# Altium schematic sheet 0059_CAMERA_CONNECTOR.SchDoc
size 848 x 558 mm
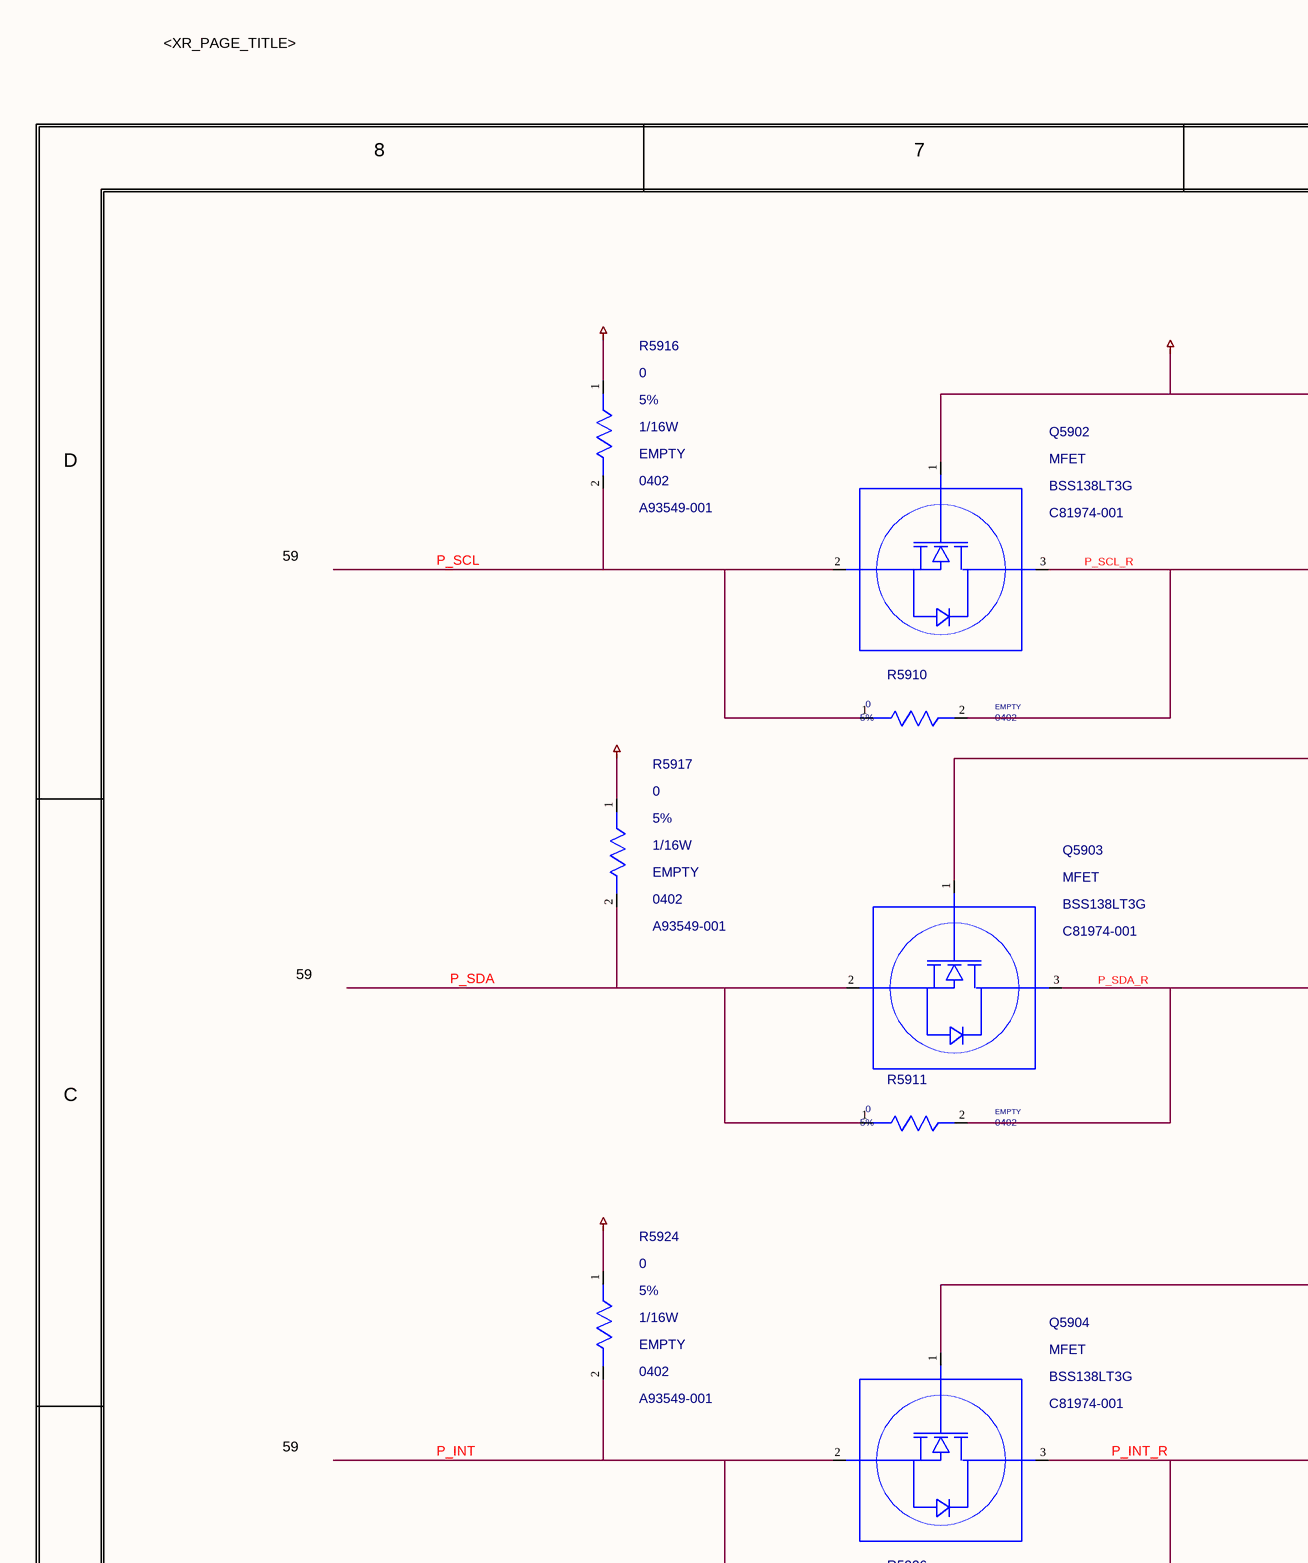
[diagram p0: 0059_CAMERA_CONNECTOR.SchDoc, top left]
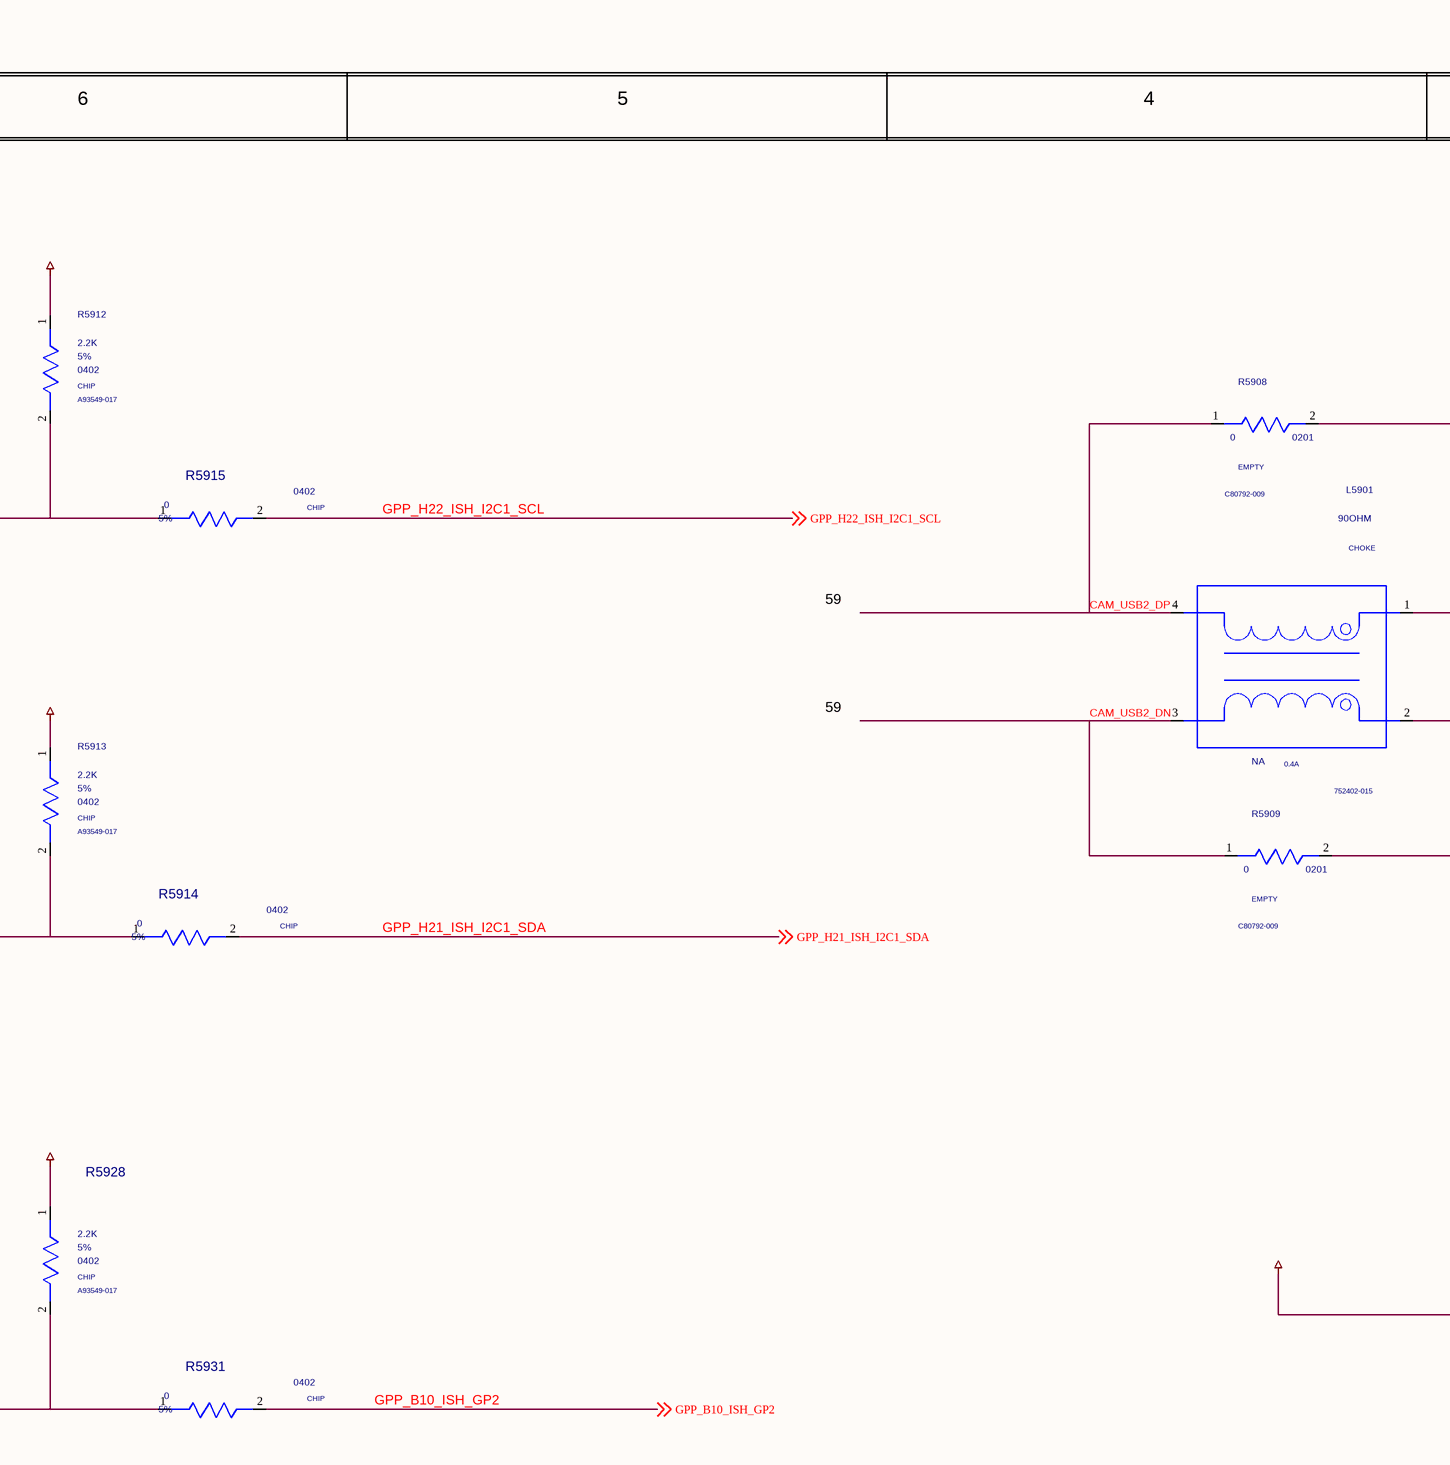
[diagram p1: 0059_CAMERA_CONNECTOR.SchDoc, top middle]
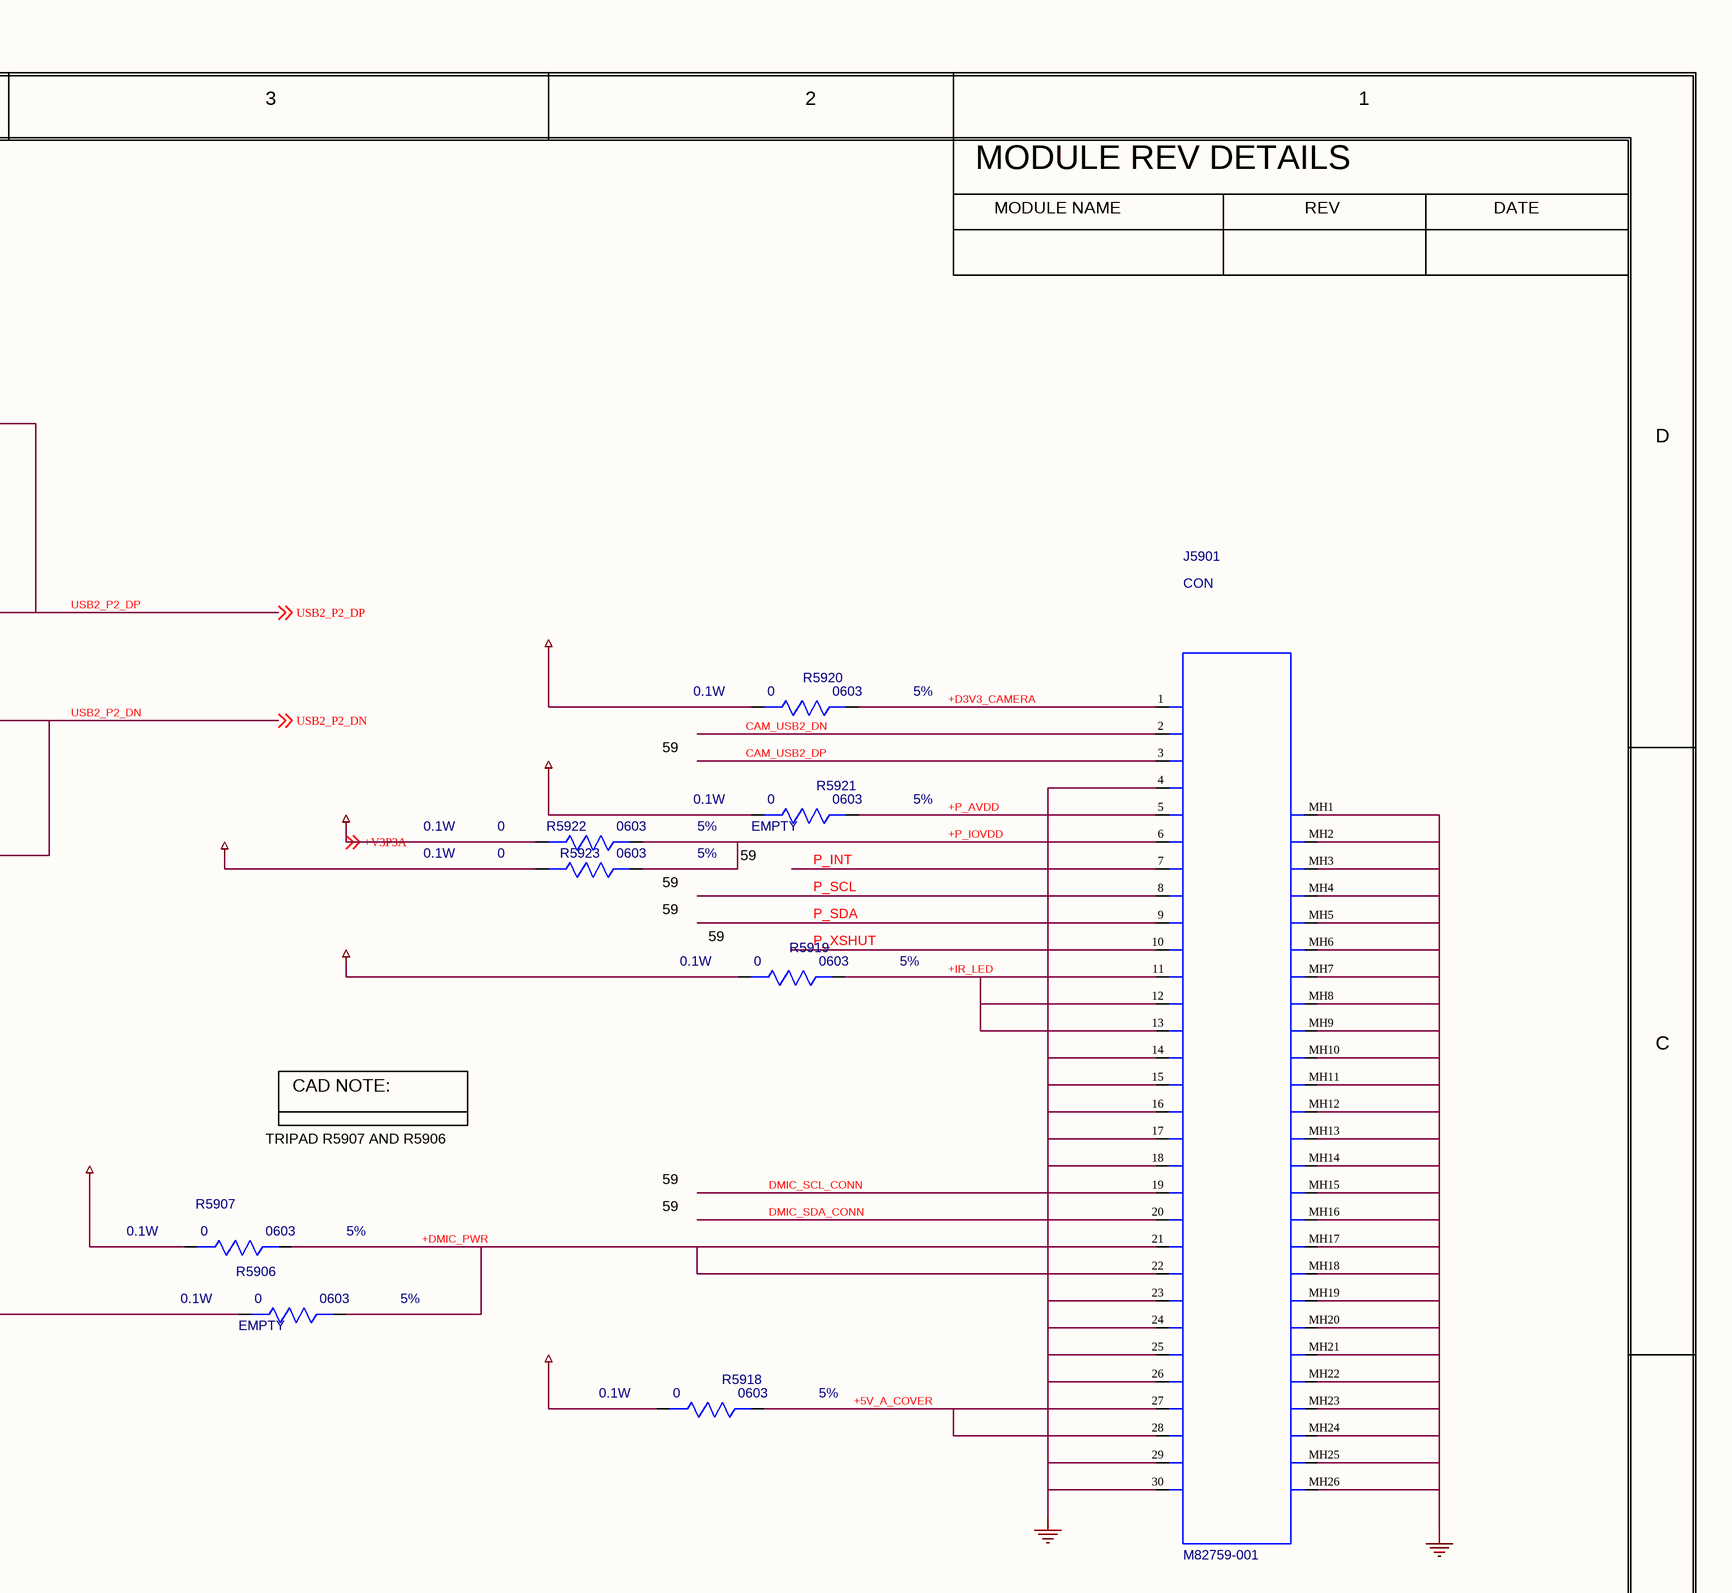
[diagram p2: 0059_CAMERA_CONNECTOR.SchDoc, top right]
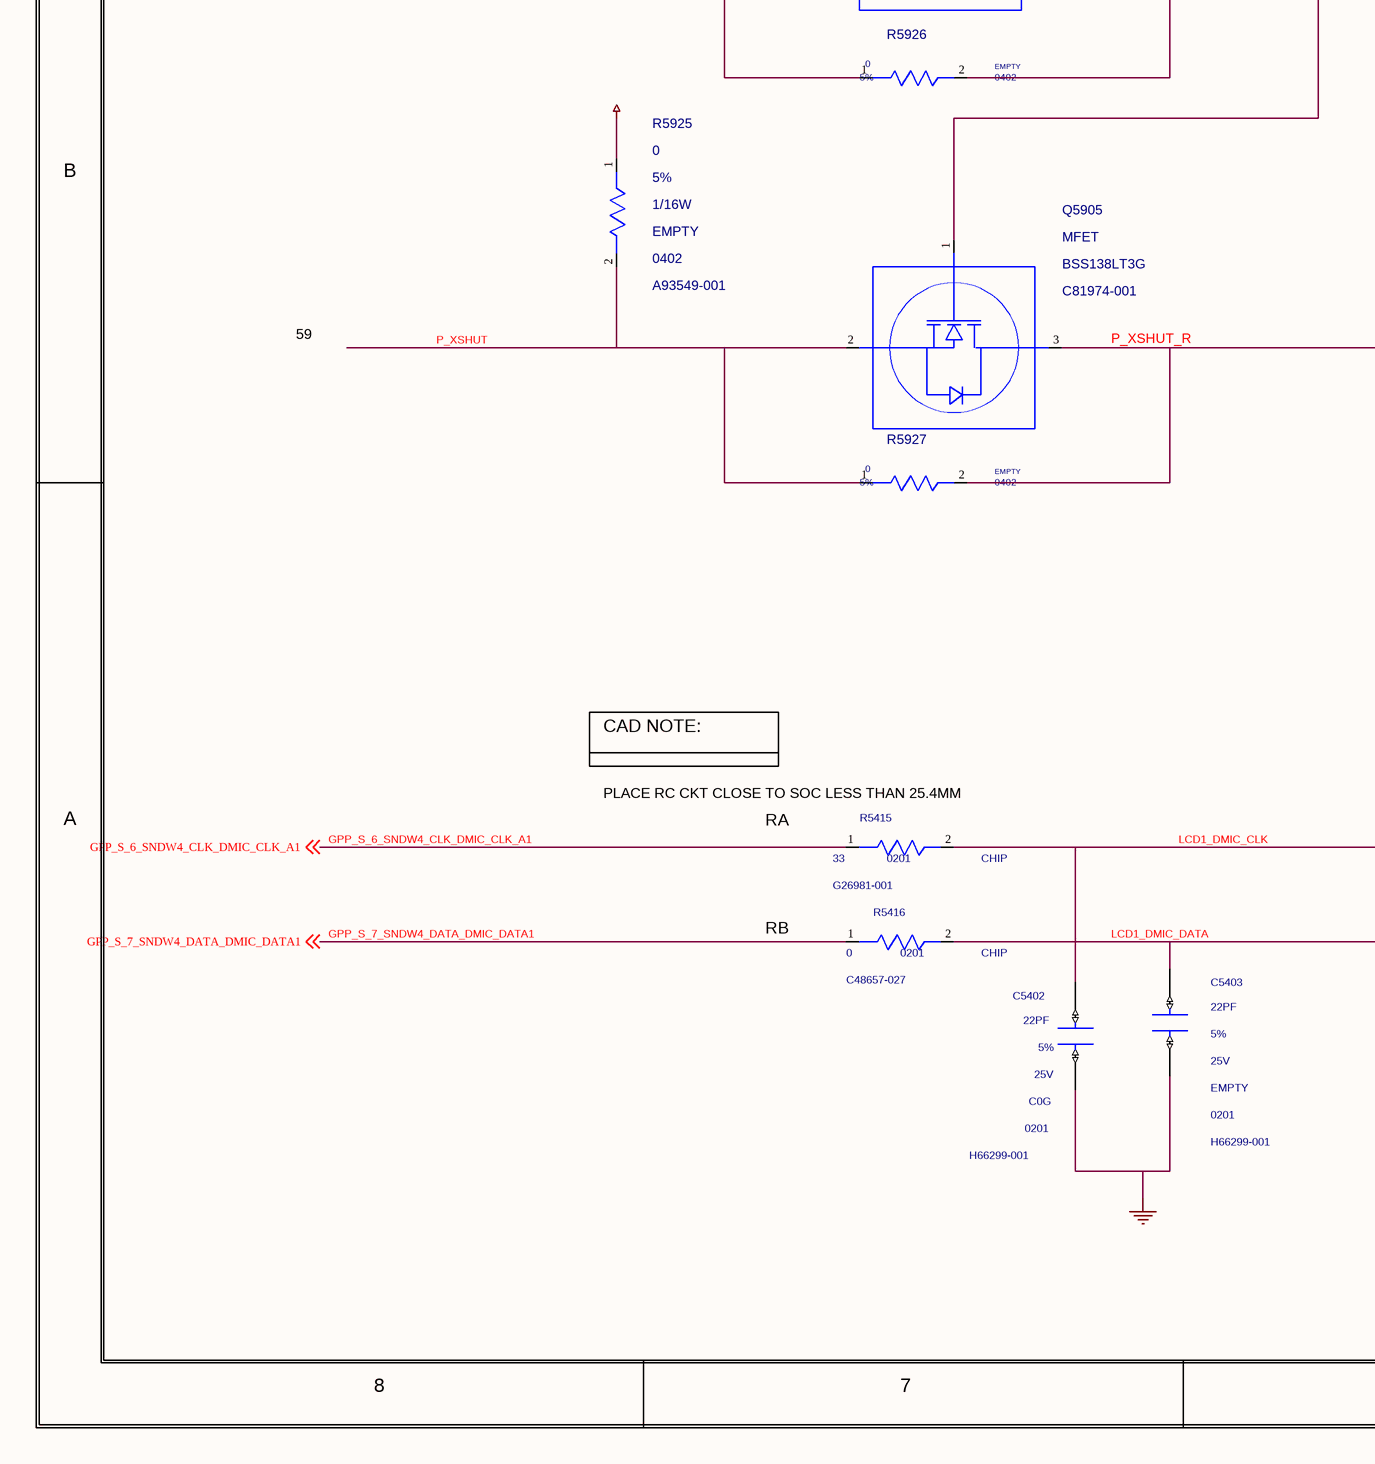
[diagram p3: 0059_CAMERA_CONNECTOR.SchDoc, bottom left]
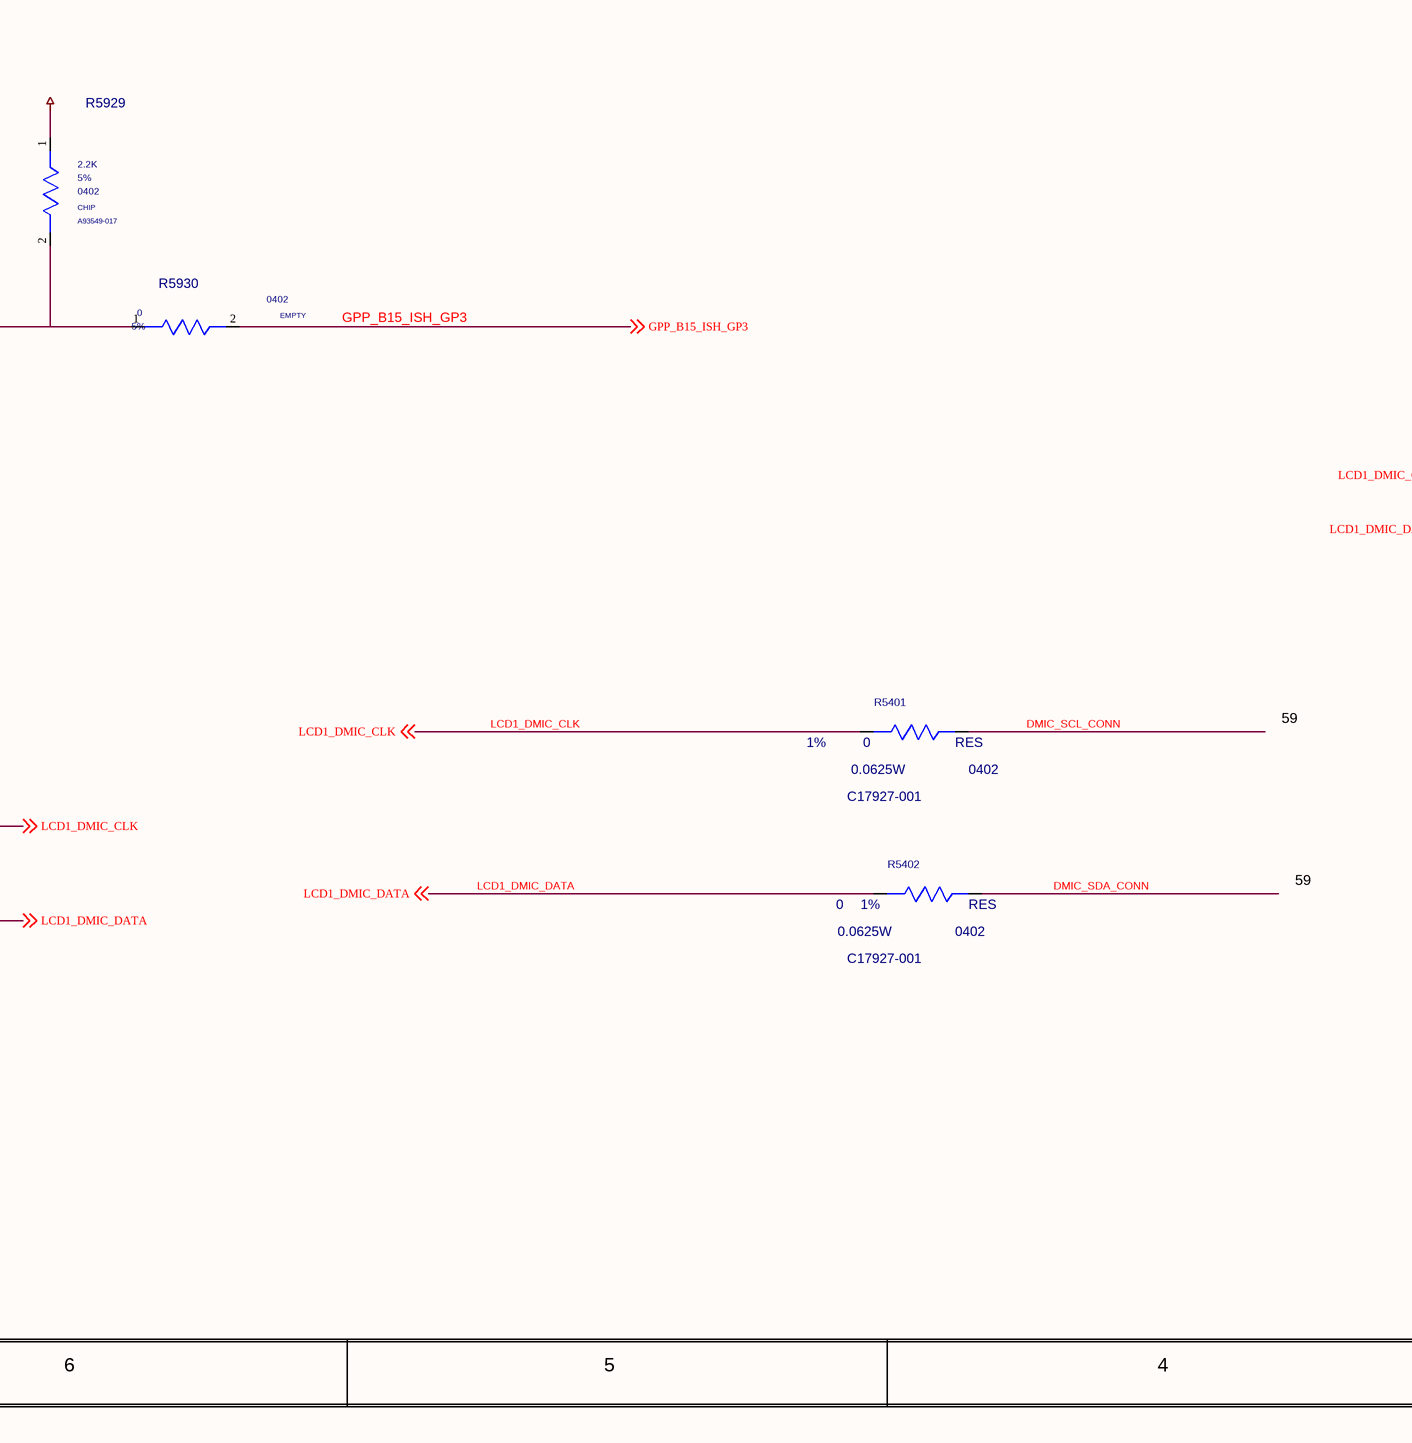
[diagram p4: 0059_CAMERA_CONNECTOR.SchDoc, bottom middle]
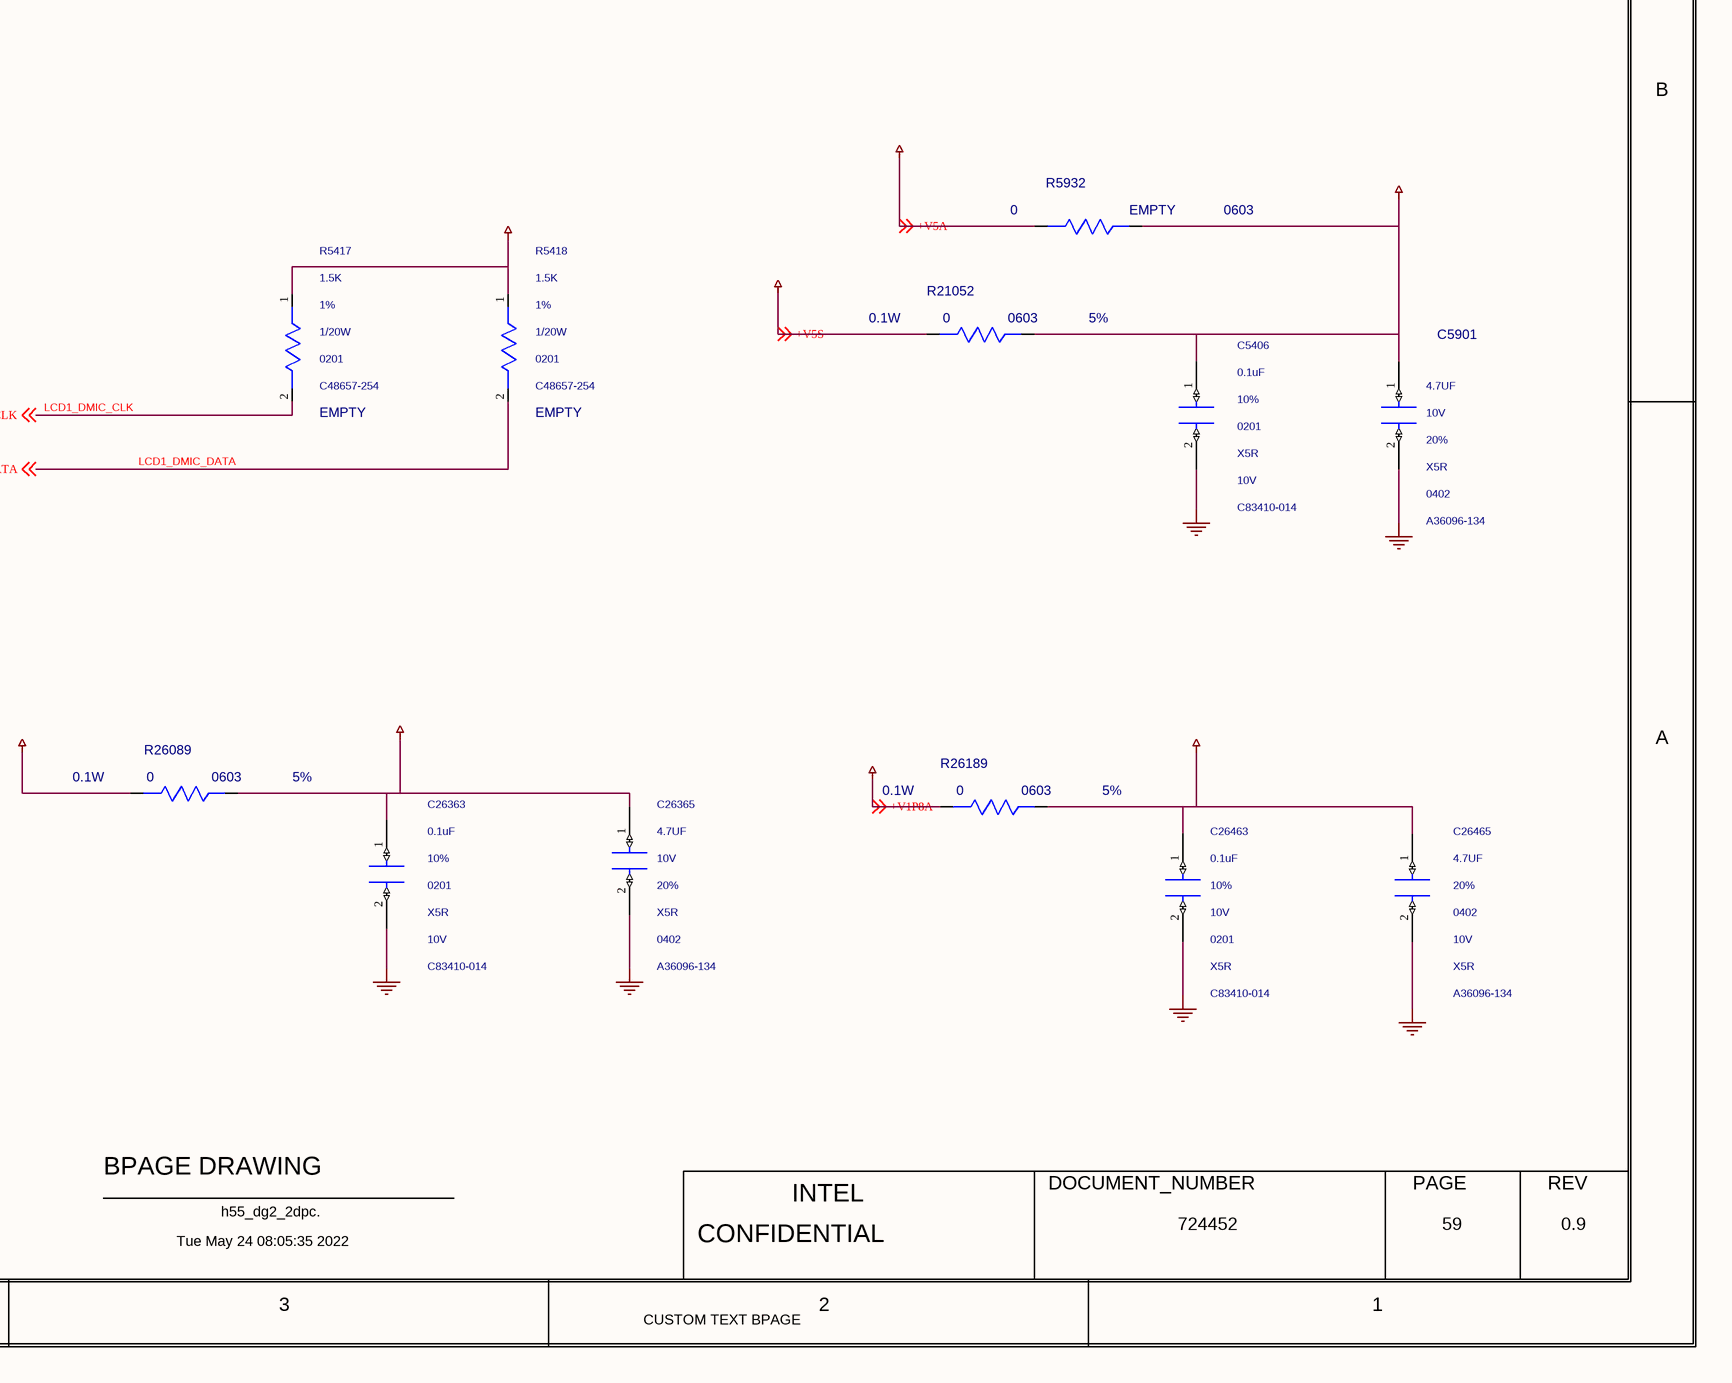
[diagram p5: 0059_CAMERA_CONNECTOR.SchDoc, bottom right]

## Parts
C5402  22PF  MATERIAL: C0G  PACK_TYPE: 0201  PART_NUMBER: H66299-001  TOLERANCE: 5%  VOLTAGE: 25V  [CTK0_SM0201_630X330_MA]
C5403  22PF  MATERIAL: EMPTY  PACK_TYPE: 0201  PART_NUMBER: H66299-001  TOLERANCE: 5%  VOLTAGE: 25V  [CTK0_SM0201_630X330_MA]
C5406  0.1uF  MATERIAL: X5R  PACK_TYPE: 0201  PART_NUMBER: C83410-014  TOLERANCE: 10%  VOLTAGE: 10V  [SMC0201IA]
C5901  4.7UF  MATERIAL: X5R  PACK_TYPE: 0402  PART_NUMBER: A36096-134  TOLERANCE: 20%  VOLTAGE: 10V  [SMC0402IA]
C26363  0.1uF  MATERIAL: X5R  PACK_TYPE: 0201  PART_NUMBER: C83410-014  TOLERANCE: 10%  VOLTAGE: 10V  [SMC0201IA]
C26365  4.7UF  MATERIAL: X5R  PACK_TYPE: 0402  PART_NUMBER: A36096-134  TOLERANCE: 20%  VOLTAGE: 10V  [SMC0402IA]
C26463  0.1uF  MATERIAL: X5R  PACK_TYPE: 0201  PART_NUMBER: C83410-014  TOLERANCE: 10%  VOLTAGE: 10V  [SMC0201IA]
C26465  4.7UF  MATERIAL: X5R  PACK_TYPE: 0402  PART_NUMBER: A36096-134  TOLERANCE: 20%  VOLTAGE: 10V  [SMC0402IA]
J5901  MATERIAL: CON  PART_NUMBER: M82759-001  [CTK1_B2B_SJR_1X30_26EM_400_MA_VR]  (hidden comment: C_B2B_1X30_26EM)
L5901  90OHM  CURRENT: 0.4A  MATERIAL: CHOKE  PART_NUMBER: 752402-015  TOLERANCE: NA  [SMI4_79X47IA]
Q5902  BSS138LT3G  MATERIAL: MFET  PART_NUMBER: C81974-001  [CTK2_SOT23_1400X3040_950_MA]
Q5903  BSS138LT3G  MATERIAL: MFET  PART_NUMBER: C81974-001  [CTK2_SOT23_1400X3040_950_MA]
Q5904  BSS138LT3G  MATERIAL: MFET  PART_NUMBER: C81974-001  [CTK2_SOT23_1400X3040_950_MA]
Q5905  BSS138LT3G  MATERIAL: MFET  PART_NUMBER: C81974-001  [CTK2_SOT23_1400X3040_950_MA]
R5401  0  MATERIAL: RES  PACK_TYPE: 0402  PART_NUMBER: C17927-001  TOLERANCE: 1%  WATTAGE: 0.0625W  [CTK0_SM0402_1100X550_MA]
R5402  0  MATERIAL: RES  PACK_TYPE: 0402  PART_NUMBER: C17927-001  TOLERANCE: 1%  WATTAGE: 0.0625W  [CTK0_SM0402_1100X550_MA]
R5415  33  MATERIAL: CHIP  PACK_TYPE: 0201  PART_NUMBER: G26981-001  [SMR0201IA]
R5416  0  MATERIAL: CHIP  PACK_TYPE: 0201  PART_NUMBER: C48657-027  [SMR0201IA]
R5417  1.5K  MATERIAL: EMPTY  PACK_TYPE: 0201  PART_NUMBER: C48657-254  TOLERANCE: 1%  WATTAGE: 1/20W  [SMR0201IA]
R5418  1.5K  MATERIAL: EMPTY  PACK_TYPE: 0201  PART_NUMBER: C48657-254  TOLERANCE: 1%  WATTAGE: 1/20W  [SMR0201IA]
R5906  0  MATERIAL: EMPTY  PACK_TYPE: 0603  TOLERANCE: 5%  WATTAGE: 0.1W  [CTK0_SM0603_1700X950_MA]
R5907  0  PACK_TYPE: 0603  TOLERANCE: 5%  WATTAGE: 0.1W  [CTK0_SM0603_1700X950_MA]
R5908  0  MATERIAL: EMPTY  PACK_TYPE: 0201  PART_NUMBER: C80792-009  [SMR0201IA]
R5909  0  MATERIAL: EMPTY  PACK_TYPE: 0201  PART_NUMBER: C80792-009  [SMR0201IA]
R5910  0  MATERIAL: EMPTY  PACK_TYPE: 0402  TOLERANCE: 5%  [SMR0402IA]
R5911  0  MATERIAL: EMPTY  PACK_TYPE: 0402  TOLERANCE: 5%  [SMR0402IA]
R5912  2.2K  MATERIAL: CHIP  PACK_TYPE: 0402  PART_NUMBER: A93549-017  TOLERANCE: 5%  [SMR0402IA]
R5913  2.2K  MATERIAL: CHIP  PACK_TYPE: 0402  PART_NUMBER: A93549-017  TOLERANCE: 5%  [SMR0402IA]
R5914  0  MATERIAL: CHIP  PACK_TYPE: 0402  TOLERANCE: 5%  [SMR0402IA]
R5915  0  MATERIAL: CHIP  PACK_TYPE: 0402  TOLERANCE: 5%  [SMR0402IA]
R5916  0  MATERIAL: EMPTY  PACK_TYPE: 0402  PART_NUMBER: A93549-001  TOLERANCE: 5%  WATTAGE: 1/16W  [SMR0402IA]
R5917  0  MATERIAL: EMPTY  PACK_TYPE: 0402  PART_NUMBER: A93549-001  TOLERANCE: 5%  WATTAGE: 1/16W  [SMR0402IA]
R5918  0  PACK_TYPE: 0603  TOLERANCE: 5%  WATTAGE: 0.1W  [CTK0_SM0603_1700X950_MA]
R5919  0  PACK_TYPE: 0603  TOLERANCE: 5%  WATTAGE: 0.1W  [CTK0_SM0603_1700X950_MA]
R5920  0  PACK_TYPE: 0603  TOLERANCE: 5%  WATTAGE: 0.1W  [CTK0_SM0603_1700X950_MA]
R5921  0  PACK_TYPE: 0603  TOLERANCE: 5%  WATTAGE: 0.1W  [CTK0_SM0603_1700X950_MA]
R5922  0  MATERIAL: EMPTY  PACK_TYPE: 0603  TOLERANCE: 5%  WATTAGE: 0.1W  [CTK0_SM0603_1700X950_MA]
R5923  0  PACK_TYPE: 0603  TOLERANCE: 5%  WATTAGE: 0.1W  [CTK0_SM0603_1700X950_MA]
R5924  0  MATERIAL: EMPTY  PACK_TYPE: 0402  PART_NUMBER: A93549-001  TOLERANCE: 5%  WATTAGE: 1/16W  [SMR0402IA]
R5925  0  MATERIAL: EMPTY  PACK_TYPE: 0402  PART_NUMBER: A93549-001  TOLERANCE: 5%  WATTAGE: 1/16W  [SMR0402IA]
R5926  0  MATERIAL: EMPTY  PACK_TYPE: 0402  TOLERANCE: 5%  [SMR0402IA]
R5927  0  MATERIAL: EMPTY  PACK_TYPE: 0402  TOLERANCE: 5%  [SMR0402IA]
R5928  2.2K  MATERIAL: CHIP  PACK_TYPE: 0402  PART_NUMBER: A93549-017  TOLERANCE: 5%  [SMR0402IA]
R5929  2.2K  MATERIAL: CHIP  PACK_TYPE: 0402  PART_NUMBER: A93549-017  TOLERANCE: 5%  [SMR0402IA]
R5930  0  MATERIAL: EMPTY  PACK_TYPE: 0402  TOLERANCE: 5%  [SMR0402IA]
R5931  0  MATERIAL: CHIP  PACK_TYPE: 0402  TOLERANCE: 5%  [SMR0402IA]
R5932  0  MATERIAL: EMPTY  PACK_TYPE: 0603  [CTK2_SM0603_1700X950_MA]
R21052  0  PACK_TYPE: 0603  TOLERANCE: 5%  WATTAGE: 0.1W  [CTK0_SM0603_1700X950_MA]
R26089  0  PACK_TYPE: 0603  TOLERANCE: 5%  WATTAGE: 0.1W  [CTK0_SM0603_1700X950_MA]
R26189  0  PACK_TYPE: 0603  TOLERANCE: 5%  WATTAGE: 0.1W  [CTK0_SM0603_1700X950_MA]

## Nets
+V1P8A: Q5902.1(G) Q5903.1(G) Q5904.1(G) Q5905.1(G) R5916.1(A) R5917.1(A) R5923.1(A) R5924.1(A) R5925.1(A) R26189.1(A) ; off-sheet +V1P8A
+V1P8A_DMIC: C26463.1(A) C26465.1(A) R5417.1(A) R5418.1(A) R5907.1(A) R26189.2(B)
+V3P3A: R5912.1(A) R5913.1(A) R5922.1(A) R5928.1(A) R5929.1(A) R26089.1(A) ; off-sheet +V3P3A
+V3P3A_CAMERA: C26363.1(A) C26365.1(A) R5906.1(A) R5920.1(A) R5921.1(A) R26089.2(B)
+V5A: R5932.1(A) ; off-sheet +V5A
+V5A_A_BL: C5406.1(A) C5901.1(A) R5918.1(A) R5919.1(A) R5932.2(B) R21052.2(B)
+V5S: R21052.1(A) ; off-sheet +V5S
GND: C5402.2(B) C5403.2(B) C5406.2(B) C5901.2(B) C26363.2(B) C26365.2(B) C26463.2(B) C26465.2(B) J5901.4(IO4) J5901.14(IO14) J5901.15(IO15) J5901.16(IO16) J5901.17(IO17) J5901.18(IO18) J5901.23(IO23) J5901.24(IO24) J5901.25(IO25) J5901.26(IO26) J5901.29(IO29) J5901.30(IO30) J5901.MH1 J5901.MH2 J5901.MH3 J5901.MH4 J5901.MH5 J5901.MH6 J5901.MH7 J5901.MH8 J5901.MH9 J5901.MH10 J5901.MH11 J5901.MH12 J5901.MH13 J5901.MH14 J5901.MH15 J5901.MH16 J5901.MH17 J5901.MH18 J5901.MH19 J5901.MH20 J5901.MH21 J5901.MH22 J5901.MH23 J5901.MH24 J5901.MH25 J5901.MH26
+5V_A_COVER: J5901.27(IO27) J5901.28(IO28) R5918.2(B)
+D3V3_CAMERA: J5901.1(IO1) R5920.2(B)
+DMIC_PWR: J5901.21(IO21) J5901.22(IO22) R5906.2(B) R5907.2(B)
+IR_LED: J5901.11(IO11) J5901.12(IO12) J5901.13(IO13) R5919.2(B)
+P_AVDD: J5901.5(IO5) R5921.2(B)
+P_IOVDD: J5901.6(IO6) R5922.2(B) R5923.2(B)
CAM_USB2_DN: J5901.2(IO2) L5901.3(IN_2) R5909.1(A)
CAM_USB2_DP: J5901.3(IO3) L5901.4(OUT_1) R5908.1(A)
DMIC_SCL_CONN: J5901.19(IO19) R5401.2(B)
DMIC_SDA_CONN: J5901.20(IO20) R5402.2(B)
GPP_B10_ISH_GP2: R5931.2(B) ; off-sheet GPP_B10_ISH_GP2
GPP_B15_ISH_GP3: R5930.2(B) ; off-sheet GPP_B15_ISH_GP3
GPP_H21_ISH_I2C1_SDA: R5914.2(B) ; off-sheet GPP_H21_ISH_I2C1_SDA
GPP_H22_ISH_I2C1_SCL: R5915.2(B) ; off-sheet GPP_H22_ISH_I2C1_SCL
GPP_S_6_SNDW4_CLK_DMIC_CLK_A1: R5415.1(A) ; off-sheet GPP_S_6_SNDW4_CLK_DMIC_CLK_A1
GPP_S_7_SNDW4_DATA_DMIC_DATA1: R5416.1(A) ; off-sheet GPP_S_7_SNDW4_DATA_DMIC_DATA1
LCD1_DMIC_CLK: C5402.1(A) R5401.1(A) R5415.2(B) R5417.2(B) ; off-sheet LCD1_DMIC_CLK
LCD1_DMIC_DATA: C5403.1(A) R5402.1(A) R5416.2(B) R5418.2(B) ; off-sheet LCD1_DMIC_DATA
P_INT: J5901.7(IO7) Q5904.2(S) R5924.2(B) R5926.1(A)
P_INT_R: Q5904.3(D) R5926.2(B) R5928.2(B) R5931.1(A)
P_SCL: J5901.8(IO8) Q5902.2(S) R5910.1(A) R5916.2(B)
P_SCL_R: Q5902.3(D) R5910.2(B) R5912.2(B) R5915.1(A)
P_SDA: J5901.9(IO9) Q5903.2(S) R5911.1(A) R5917.2(B)
P_SDA_R: Q5903.3(D) R5911.2(B) R5913.2(B) R5914.1(A)
P_XSHUT: J5901.10(IO10) Q5905.2(S) R5925.2(B) R5927.1(A)
P_XSHUT_R: Q5905.3(D) R5927.2(B) R5929.2(B) R5930.1(A)
USB2_P2_DN: L5901.2(OUT_2) R5909.2(B) ; off-sheet USB2_P2_DN
USB2_P2_DP: L5901.1(IN_1) R5908.2(B) ; off-sheet USB2_P2_DP

## Notes on the sheet
- <XR_PAGE_TITLE>
- 8
- 7
- 6
- 5
- 4
- 3
- 2
- 1
- MODULE REV DETAILS
- MODULE NAME
- REV
- DATE
- D
- 59
- (near R5921) 59
- (near R5919) 59
- C
- TRIPAD R5907 AND R5906
- CAD NOTE:
- B
- (near R5415) PLACE RC CKT CLOSE TO SOC LESS THAN 25.4MM
- A
- RA
- RB
- BPAGE DRAWING
- INTEL
- DOCUMENT_NUMBER
- PAGE
- Tue May 24 08:05:35 2022
- h55_dg2_2dpc.
- CONFIDENTIAL
- 724452
- 0.9
- CUSTOM TEXT BPAGE

## Library data of the parts
C5402 = C_CAP: CDS_PHYS_PART_NAME: C_CAP_0201-H66299-001,C0G,22PF,25V,5%,TK0,GENERIC; CDS_LMAN_SYM_OUTLINE: -50,50,50,-50; FP_TECH: TK0; IP: GENERIC; ROOM: NONE; OriginalSymbolOrigin: (-50,25); XY: (3625,700); VER: 1; SUB_ROOM: DECOUPLING; ROT: 0; PHYS_PAGE: 59; LOCATION: C5402; DRAWING: @RVP1_ADL_SB_ADP_S_DDR5_SODIMM_2DPC_LIB.H55_DG2_2DPC(SCH_1):PAGE59; CDS_LIB: c_discrete; VARIANT: ?; PCB Footprint: CTK0_SM0201_630X330_MA; CHIPS_PART_NAME: C_CAP; CDS_PART_NAME: C_CAP_0201-H66299-001,C0G,22PF,25V,5%,TK0,GENERIC; CDS_LOCATION: C5402
C5403 = C_CAP: CDS_PHYS_PART_NAME: C_CAP_0201-H66299-001,EMPTY,22PF,25V,5%,TK0,GENERIC; CDS_LMAN_SYM_OUTLINE: -50,50,50,-50; FP_TECH: TK0; IP: GENERIC; ROOM: NONE; OriginalSymbolOrigin: (-50,25); XY: (3800,725); VER: 1; SUB_ROOM: DECOUPLING; ROT: 2; PHYS_PAGE: 59; LOCATION: C5403; DRAWING: @RVP1_ADL_SB_ADP_S_DDR5_SODIMM_2DPC_LIB.H55_DG2_2DPC(SCH_1):PAGE59; CDS_LIB: c_discrete; VARIANT: ?; PCB Footprint: CTK0_SM0201_630X330_MA; CHIPS_PART_NAME: C_CAP; CDS_PART_NAME: C_CAP_0201-H66299-001,EMPTY,22PF,25V,5%,TK0,GENERIC; CDS_LOCATION: C5403
C5406 = CAP: CDS_PHYS_PART_NAME: CAP_0201-C83410-014,X5R,0.1UF,10V,10%,LPDB,GENERIC; OriginalSymbolOrigin: (-50,25); XY: (9025,1700); VER: 1; SUB_ROOM_2: DECOUPLING; SUB_ROOM_1: TOUCH-1; ROT: 0; PHYS_PAGE: 59; LOCATION: C5406; DRAWING: @RVP1_ADL_SB_ADP_S_DDR5_SODIMM_2DPC_LIB.H55_DG2_2DPC(SCH_1):PAGE59; CDS_LIB: discrete; PCB Footprint: SMC0201IA; CHIPS_PART_NAME: CAP; CDS_PART_NAME: CAP_0201-C83410-014,X5R,0.1UF,10V,10%,LPDB,GENERIC; CDS_LOCATION: C5406
C5901 = CAP: CDS_PHYS_PART_NAME: CAP_0402-A36096-134,X5R,4.7UF,10V,20%,LPDB,GENERIC; OriginalSymbolOrigin: (-50,25); XY: (9400,1700); VER: 1; SUB_ROOM_2: DECOUPLING; SUB_ROOM_1: TOUCH-1; ROT: 0; PHYS_PAGE: 59; LOCATION: C5901; DRAWING: @RVP1_ADL_SB_ADP_S_DDR5_SODIMM_2DPC_LIB.H55_DG2_2DPC(SCH_1):PAGE59; CDS_LIB: discrete; PCB Footprint: SMC0402IA; CHIPS_PART_NAME: CAP; CDS_PART_NAME: CAP_0402-A36096-134,X5R,4.7UF,10V,20%,LPDB,GENERIC; CDS_LOCATION: C5901
C26363 = CAP: CDS_PHYS_PART_NAME: CAP_0201-C83410-014,X5R,0.1UF,10V,10%,LPDB,GENERIC; OriginalSymbolOrigin: (-50,25); XY: (7525,850); VER: 1; SUB_ROOM_2: DECOUPLING; SUB_ROOM_1: TOUCH-1; ROT: 0; PHYS_PAGE: 59; LOCATION: C26363; DRAWING: @RVP1_ADL_SB_ADP_S_DDR5_SODIMM_2DPC_LIB.H55_DG2_2DPC(SCH_1):PAGE59; CDS_LIB: discrete; PCB Footprint: SMC0201IA; CHIPS_PART_NAME: CAP; CDS_PART_NAME: CAP_0201-C83410-014,X5R,0.1UF,10V,10%,LPDB,GENERIC; CDS_LOCATION: C26363
C26365 = CAP: CDS_PHYS_PART_NAME: CAP_0402-A36096-134,X5R,4.7UF,10V,20%,LPDB,GENERIC; OriginalSymbolOrigin: (-50,25); XY: (7975,875); VER: 1; SUB_ROOM_2: DECOUPLING; SUB_ROOM_1: TOUCH-1; ROT: 0; PHYS_PAGE: 59; LOCATION: C26365; DRAWING: @RVP1_ADL_SB_ADP_S_DDR5_SODIMM_2DPC_LIB.H55_DG2_2DPC(SCH_1):PAGE59; CDS_LIB: discrete; PCB Footprint: SMC0402IA; CHIPS_PART_NAME: CAP; CDS_PART_NAME: CAP_0402-A36096-134,X5R,4.7UF,10V,20%,LPDB,GENERIC; CDS_LOCATION: C26365
C26463 = CAP: CDS_PHYS_PART_NAME: CAP_0201-C83410-014,X5R,0.1UF,10V,10%,LPDB,GENERIC; OriginalSymbolOrigin: (-50,25); XY: (9000,825); VER: 1; SUB_ROOM_2: DECOUPLING; SUB_ROOM_1: TOUCH-1; ROT: 0; PHYS_PAGE: 59; LOCATION: C26463; DRAWING: @RVP1_ADL_SB_ADP_S_DDR5_SODIMM_2DPC_LIB.H55_DG2_2DPC(SCH_1):PAGE59; CDS_LIB: discrete; PCB Footprint: SMC0201IA; CHIPS_PART_NAME: CAP; CDS_PART_NAME: CAP_0201-C83410-014,X5R,0.1UF,10V,10%,LPDB,GENERIC; CDS_LOCATION: C26463
C26465 = CAP: CDS_PHYS_PART_NAME: CAP_0402-A36096-134,X5R,4.7UF,10V,20%,LPDB,GENERIC; OriginalSymbolOrigin: (-50,25); XY: (9425,825); VER: 1; SUB_ROOM_2: DECOUPLING; SUB_ROOM_1: TOUCH-1; ROT: 0; PHYS_PAGE: 59; LOCATION: C26465; DRAWING: @RVP1_ADL_SB_ADP_S_DDR5_SODIMM_2DPC_LIB.H55_DG2_2DPC(SCH_1):PAGE59; CDS_LIB: discrete; PCB Footprint: SMC0402IA; CHIPS_PART_NAME: CAP; CDS_PART_NAME: CAP_0402-A36096-134,X5R,4.7UF,10V,20%,LPDB,GENERIC; CDS_LOCATION: C26465
J5901 = C_B2B_1X30_26EM: CDS_PHYS_PART_NAME: C_B2B_1X30_26EM_SM-M82759-001,CON,B2B_1X30_26EM,TK1,GENERIC; CDS_LMAN_SYM_OUTLINE: -100,800,100,-850; FP_TECH: TK1; IP: GENERIC; PACK_TYPE: SM; ROOM: NONE; OriginalSymbolOrigin: (-125,800); XY: (9100,3350); VER: 1; ROT: 0; PHYS_PAGE: 59; LOCATION: J5901; DRAWING: @RVP1_ADL_SB_ADP_S_DDR5_SODIMM_2DPC_LIB.H55_DG2_2DPC(SCH_1):PAGE59; CDS_LIB: local; VARIANT: ?; PCB Footprint: CTK1_B2B_SJR_1X30_26EM_400_MA_VR; SEC_TYPE: SM; CHIPS_PART_NAME: C_B2B_1X30_26EM; CDS_PART_NAME: C_B2B_1X30_26EM_SM-M82759-001,CON,B2B_1X30_26EM,TK1,GENERIC; CDS_LOCATION: J5901
L5901 = IND_4PIN: CDS_PHYS_PART_NAME: IND_4PIN_0805-752402-015,CHOKE,90OHM,NA,0.4A,LPDB,GENERIC; CDS_LMAN_SYM_OUTLINE: -200,150,150,-150; PACK_TYPE: 0805; OriginalSymbolOrigin: (-225,150); XY: (6550,4125); VER: 2; PHYS_PAGE: 59; LOCATION: L5901; IP: GENERIC; FP_TECH: LPDB; DRAWING: @RVP1_ADL_SB_ADP_S_DDR5_SODIMM_2DPC_LIB.H55_DG2_2DPC(SCH_1):PAGE59; CDS_LIB: discrete; PCB Footprint: SMI4_79X47IA; SEC_TYPE: 0805; ROT: 2; CHIPS_PART_NAME: IND_4PIN; CDS_PART_NAME: IND_4PIN_0805-752402-015,CHOKE,90OHM,NA,0.4A,LPDB,GENERIC; CDS_LOCATION: L5901
Q5902 = C_MOSFET_N#1: CDS_PHYS_PART_NAME: C_MOSFET_N_SOT23-C81974-001,MFET,BSS138LT3G,TK2,GENERIC; CDS_LMAN_SYM_OUTLINE: -150,150,150,-150; FP_TECH: TK2; IP: GENERIC; PACK_TYPE: SOT23; ROOM: NONE; OriginalSymbolOrigin: (-175,175); XY: (3375,4400); VER: 1; ROT: 5; PHYS_PAGE: 59; LOCATION: Q5902; DRAWING: @RVP1_ADL_SB_ADP_S_DDR5_SODIMM_2DPC_LIB.H55_DG2_2DPC(SCH_1):PAGE59; CDS_LIB: local; VARIANT: ?; PCB Footprint: CTK2_SOT23_1400X3040_950_MA; CHIPS_PART_NAME: C_MOSFET_N; CDS_PART_NAME: C_MOSFET_N_SOT23-C81974-001,MFET,BSS138LT3G,TK2,GENERIC; CDS_LOCATION: Q5902
Q5903 = C_MOSFET_N#1: CDS_PHYS_PART_NAME: C_MOSFET_N_SOT23-C81974-001,MFET,BSS138LT3G,TK2,GENERIC; CDS_LMAN_SYM_OUTLINE: -150,150,150,-150; FP_TECH: TK2; IP: GENERIC; PACK_TYPE: SOT23; ROOM: NONE; OriginalSymbolOrigin: (-175,175); XY: (3400,3625); VER: 1; ROT: 5; PHYS_PAGE: 59; LOCATION: Q5903; DRAWING: @RVP1_ADL_SB_ADP_S_DDR5_SODIMM_2DPC_LIB.H55_DG2_2DPC(SCH_1):PAGE59; CDS_LIB: local; VARIANT: ?; PCB Footprint: CTK2_SOT23_1400X3040_950_MA; CHIPS_PART_NAME: C_MOSFET_N; CDS_PART_NAME: C_MOSFET_N_SOT23-C81974-001,MFET,BSS138LT3G,TK2,GENERIC; CDS_LOCATION: Q5903
Q5904 = C_MOSFET_N#1: CDS_PHYS_PART_NAME: C_MOSFET_N_SOT23-C81974-001,MFET,BSS138LT3G,TK2,GENERIC; CDS_LMAN_SYM_OUTLINE: -150,150,150,-150; FP_TECH: TK2; IP: GENERIC; PACK_TYPE: SOT23; ROOM: NONE; OriginalSymbolOrigin: (-175,175); XY: (3375,2750); VER: 1; ROT: 5; PHYS_PAGE: 59; LOCATION: Q5904; DRAWING: @RVP1_ADL_SB_ADP_S_DDR5_SODIMM_2DPC_LIB.H55_DG2_2DPC(SCH_1):PAGE59; CDS_LIB: local; VARIANT: ?; PCB Footprint: CTK2_SOT23_1400X3040_950_MA; CHIPS_PART_NAME: C_MOSFET_N; CDS_PART_NAME: C_MOSFET_N_SOT23-C81974-001,MFET,BSS138LT3G,TK2,GENERIC; CDS_LOCATION: Q5904
Q5905 = C_MOSFET_N#1: CDS_PHYS_PART_NAME: C_MOSFET_N_SOT23-C81974-001,MFET,BSS138LT3G,TK2,GENERIC; CDS_LMAN_SYM_OUTLINE: -150,150,150,-150; FP_TECH: TK2; IP: GENERIC; PACK_TYPE: SOT23; ROOM: NONE; OriginalSymbolOrigin: (-175,175); XY: (3400,1975); VER: 1; ROT: 5; PHYS_PAGE: 59; LOCATION: Q5905; DRAWING: @RVP1_ADL_SB_ADP_S_DDR5_SODIMM_2DPC_LIB.H55_DG2_2DPC(SCH_1):PAGE59; CDS_LIB: local; VARIANT: ?; PCB Footprint: CTK2_SOT23_1400X3040_950_MA; CHIPS_PART_NAME: C_MOSFET_N; CDS_PART_NAME: C_MOSFET_N_SOT23-C81974-001,MFET,BSS138LT3G,TK2,GENERIC; CDS_LOCATION: Q5905
R5401 = C_RES#1: CHIPS_PART_NAME: C_RES; CDS_PHYS_PART_NAME: C_RES_0402-C17927-001,RES,0,1%,0.0625W,TK0,GENERIC; CDS_LMAN_SYM_OUTLINE: -50,50,50,-50; FP_TECH: TK0; IP: GENERIC; ROOM: NONE; OriginalSymbolOrigin: (-75,25); XY: (5875,1225); VER: 1; SUB_ROOM_2: MISC; SUB_ROOM_1: TOUCH-1; PHYS_PAGE: 59; LOCATION: R5401; DRAWING: @RVP1_ADL_SB_ADP_S_DDR5_SODIMM_2DPC_LIB.H55_DG2_2DPC(SCH_1):PAGE59; CDS_LIB: c_discrete; VARIANT: ?; PCB Footprint: CTK0_SM0402_1100X550_MA; SEC_TYPE: 0402; ROT: 0; CDS_PART_NAME: C_RES_0402-C17927-001,RES,0,1%,0.0625W,TK0,GENERIC; CDS_LOCATION: R5401
R5402 = C_RES#1: CHIPS_PART_NAME: C_RES; CDS_PHYS_PART_NAME: C_RES_0402-C17927-001,RES,0,1%,0.0625W,TK0,GENERIC; CDS_LMAN_SYM_OUTLINE: -50,50,50,-50; FP_TECH: TK0; IP: GENERIC; ROOM: NONE; OriginalSymbolOrigin: (-75,25); XY: (5900,925); VER: 1; SUB_ROOM_2: MISC; SUB_ROOM_1: TOUCH-1; PHYS_PAGE: 59; LOCATION: R5402; DRAWING: @RVP1_ADL_SB_ADP_S_DDR5_SODIMM_2DPC_LIB.H55_DG2_2DPC(SCH_1):PAGE59; CDS_LIB: c_discrete; VARIANT: ?; PCB Footprint: CTK0_SM0402_1100X550_MA; SEC_TYPE: 0402; ROT: 0; CDS_PART_NAME: C_RES_0402-C17927-001,RES,0,1%,0.0625W,TK0,GENERIC; CDS_LOCATION: R5402
R5415 = RES#1: CHIPS_PART_NAME: RES; CDS_PHYS_PART_NAME: RES_0201-G26981-001,CHIP,33,5%,0.05W,LPDB,GENERIC; TOLERANCE: 5%; WATTAGE: 0.05W; OriginalSymbolOrigin: (-75,25); XY: (3300,1050); VER: 1; SUB_ROOM: TERMINATION; ROT: 0; PHYS_PAGE: 59; LOCATION: R5415; IP: GENERIC; FP_TECH: LPDB; DRAWING: @RVP1_ADL_SB_ADP_S_DDR5_SODIMM_2DPC_LIB.H55_DG2_2DPC(SCH_1):PAGE59; CDS_LIB: discrete; PCB Footprint: SMR0201IA; CDS_PART_NAME: RES_0201-G26981-001,CHIP,33,5%,0.05W,LPDB,GENERIC; CDS_LOCATION: R5415
R5416 = RES#1: CHIPS_PART_NAME: RES; CDS_PHYS_PART_NAME: RES_0201-C48657-027,CHIP,0,1%,1/20W,LPDB,GENERIC; TOLERANCE: 1%; WATTAGE: 1/20W; OriginalSymbolOrigin: (-75,25); XY: (3300,875); VER: 1; SUB_ROOM: TERMINATION; PHYS_PAGE: 59; LOCATION: R5416; IP: GENERIC; FP_TECH: LPDB; DRAWING: @RVP1_ADL_SB_ADP_S_DDR5_SODIMM_2DPC_LIB.H55_DG2_2DPC(SCH_1):PAGE59; CDS_LIB: discrete; PCB Footprint: SMR0201IA; ROT: 0; CDS_PART_NAME: RES_0201-C48657-027,CHIP,0,1%,1/20W,LPDB,GENERIC; CDS_LOCATION: R5416
R5417 = RES: CDS_PHYS_PART_NAME: RES_0201-C48657-254,EMPTY,1.5K,1%,1/20W,LPDB,GENERIC; OriginalSymbolOrigin: (-25,75); XY: (7350,1825); VER: 2; ROT: 0; PHYS_PAGE: 59; LOCATION: R5417; IP: GENERIC; FP_TECH: LPDB; DRAWING: @RVP1_ADL_SB_ADP_S_DDR5_SODIMM_2DPC_LIB.H55_DG2_2DPC(SCH_1):PAGE59; CDS_LIB: discrete; PCB Footprint: SMR0201IA; CHIPS_PART_NAME: RES; CDS_PART_NAME: RES_0201-C48657-254,EMPTY,1.5K,1%,1/20W,LPDB,GENERIC; CDS_LOCATION: R5417
R5418 = RES: CDS_PHYS_PART_NAME: RES_0201-C48657-254,EMPTY,1.5K,1%,1/20W,LPDB,GENERIC; OriginalSymbolOrigin: (-25,75); XY: (7750,1825); VER: 2; ROT: 0; PHYS_PAGE: 59; LOCATION: R5418; IP: GENERIC; FP_TECH: LPDB; DRAWING: @RVP1_ADL_SB_ADP_S_DDR5_SODIMM_2DPC_LIB.H55_DG2_2DPC(SCH_1):PAGE59; CDS_LIB: discrete; PCB Footprint: SMR0201IA; CHIPS_PART_NAME: RES; CDS_PART_NAME: RES_0201-C48657-254,EMPTY,1.5K,1%,1/20W,LPDB,GENERIC; CDS_LOCATION: R5418
R5906 = C_RES#1: PART_NUMBER: G22178-002; CHIPS_PART_NAME: C_RES; CDS_PHYS_PART_NAME: C_RES_0603-G22178-002,EMPTY,0,5%,0.1W,TK0,GENERIC; CDS_LMAN_SYM_OUTLINE: -50,50,50,-50; FP_TECH: TK0; IP: GENERIC; ROOM: NONE; OriginalSymbolOrigin: (-75,25); XY: (7350,2925); VER: 1; PHYS_PAGE: 59; LOCATION: R5906; DRAWING: @RVP1_ADL_SB_ADP_S_DDR5_SODIMM_2DPC_LIB.H55_DG2_2DPC(SCH_1):PAGE59; CDS_LIB: c_discrete; VARIANT: ?; PCB Footprint: CTK0_SM0603_1700X950_MA; ROT: 0; CDS_PART_NAME: C_RES_0603-G22178-002,EMPTY,0,5%,0.1W,TK0,GENERIC; CDS_LOCATION: R5906
R5907 = C_RES#1: PART_NUMBER: G22178-002; CHIPS_PART_NAME: C_RES; CDS_PHYS_PART_NAME: C_RES_0603-G22178-002,RES,0,5%,0.1W,TK0,GENERIC; CDS_LMAN_SYM_OUTLINE: -50,50,50,-50; FP_TECH: TK0; IP: GENERIC; ROOM: NONE; OriginalSymbolOrigin: (-75,25); XY: (7250,3050); VER: 1; PHYS_PAGE: 59; LOCATION: R5907; DRAWING: @RVP1_ADL_SB_ADP_S_DDR5_SODIMM_2DPC_LIB.H55_DG2_2DPC(SCH_1):PAGE59; CDS_LIB: c_discrete; MATERIAL: RES; VARIANT: ?; PCB Footprint: CTK0_SM0603_1700X950_MA; ROT: 0; CDS_PART_NAME: C_RES_0603-G22178-002,RES,0,5%,0.1W,TK0,GENERIC; CDS_LOCATION: R5907
R5908 = RES#1: CHIPS_PART_NAME: RES; CDS_PHYS_PART_NAME: RES_0201-C80792-009,EMPTY,0,5%,1/20W,LPDB,GENERIC; TOLERANCE: 5%; WATTAGE: 1/20W; OriginalSymbolOrigin: (-75,25); XY: (6525,4575); VER: 1; ROOM: ROOM_PROP_TEST_178; PHYS_PAGE: 59; LOCATION: R5908; IP: GENERIC; FP_TECH: LPDB; DRAWING: @RVP1_ADL_SB_ADP_S_DDR5_SODIMM_2DPC_LIB.H55_DG2_2DPC(SCH_1):PAGE59; CDS_LIB: discrete; PCB Footprint: SMR0201IA; ROT: 0; CDS_PART_NAME: RES_0201-C80792-009,EMPTY,0,5%,1/20W,LPDB,GENERIC; CDS_LOCATION: R5908
R5909 = RES#1: CHIPS_PART_NAME: RES; CDS_PHYS_PART_NAME: RES_0201-C80792-009,EMPTY,0,5%,1/20W,LPDB,GENERIC; TOLERANCE: 5%; WATTAGE: 1/20W; OriginalSymbolOrigin: (-75,25); XY: (6550,3775); VER: 1; ROOM: ROOM_PROP_TEST_178; PHYS_PAGE: 59; LOCATION: R5909; IP: GENERIC; FP_TECH: LPDB; DRAWING: @RVP1_ADL_SB_ADP_S_DDR5_SODIMM_2DPC_LIB.H55_DG2_2DPC(SCH_1):PAGE59; CDS_LIB: discrete; PCB Footprint: SMR0201IA; ROT: 0; CDS_PART_NAME: RES_0201-C80792-009,EMPTY,0,5%,1/20W,LPDB,GENERIC; CDS_LOCATION: R5909
R5910 = RES#1: PART_NUMBER: A93549-001; CHIPS_PART_NAME: RES; CDS_PHYS_PART_NAME: RES_0402-A93549-001,EMPTY,0,5%,1/16W,LPDB,GENERIC; WATTAGE: 1/16W; OriginalSymbolOrigin: (-75,25); XY: (3325,4125); VER: 1; PHYS_PAGE: 59; LOCATION: R5910; IP: GENERIC; FP_TECH: LPDB; DRAWING: @RVP1_ADL_SB_ADP_S_DDR5_SODIMM_2DPC_LIB.H55_DG2_2DPC(SCH_1):PAGE59; CDS_LIB: discrete; PCB Footprint: SMR0402IA; ROT: 0; CDS_PART_NAME: RES_0402-A93549-001,EMPTY,0,5%,1/16W,LPDB,GENERIC; CDS_LOCATION: R5910; ASI_MODEL: A93549-001
R5911 = RES#1: PART_NUMBER: A93549-001; CHIPS_PART_NAME: RES; CDS_PHYS_PART_NAME: RES_0402-A93549-001,EMPTY,0,5%,1/16W,LPDB,GENERIC; WATTAGE: 1/16W; OriginalSymbolOrigin: (-75,25); XY: (3325,3375); VER: 1; PHYS_PAGE: 59; LOCATION: R5911; IP: GENERIC; FP_TECH: LPDB; DRAWING: @RVP1_ADL_SB_ADP_S_DDR5_SODIMM_2DPC_LIB.H55_DG2_2DPC(SCH_1):PAGE59; CDS_LIB: discrete; PCB Footprint: SMR0402IA; ROT: 0; CDS_PART_NAME: RES_0402-A93549-001,EMPTY,0,5%,1/16W,LPDB,GENERIC; CDS_LOCATION: R5911; ASI_MODEL: A93549-001
R5912 = RES: CDS_PHYS_PART_NAME: RES_0402-A93549-017,CHIP,2.2K,5%,1/16W,LPDB,GENERIC; WATTAGE: 1/16W; OriginalSymbolOrigin: (-25,75); XY: (4275,4675); VER: 2; ROT: 0; PHYS_PAGE: 59; LOCATION: R5912; IP: GENERIC; FP_TECH: LPDB; FIN: PCH; DRAWING: @RVP1_ADL_SB_ADP_S_DDR5_SODIMM_2DPC_LIB.H55_DG2_2DPC(SCH_1):PAGE59; CDS_LIB: discrete; PCB Footprint: SMR0402IA; CHIPS_PART_NAME: RES; CDS_PART_NAME: RES_0402-A93549-017,CHIP,2.2K,5%,1/16W,LPDB,GENERIC; CDS_LOCATION: R5912; ASI_MODEL: A93549-017
R5913 = RES: CDS_PHYS_PART_NAME: RES_0402-A93549-017,CHIP,2.2K,5%,1/16W,LPDB,GENERIC; WATTAGE: 1/16W; OriginalSymbolOrigin: (-25,75); XY: (4275,3875); VER: 2; ROT: 0; PHYS_PAGE: 59; LOCATION: R5913; IP: GENERIC; FP_TECH: LPDB; FIN: PCH; DRAWING: @RVP1_ADL_SB_ADP_S_DDR5_SODIMM_2DPC_LIB.H55_DG2_2DPC(SCH_1):PAGE59; CDS_LIB: discrete; PCB Footprint: SMR0402IA; CHIPS_PART_NAME: RES; CDS_PART_NAME: RES_0402-A93549-017,CHIP,2.2K,5%,1/16W,LPDB,GENERIC; CDS_LOCATION: R5913; ASI_MODEL: A93549-017
R5914 = RES#1: PART_NUMBER: A93549-001; CHIPS_PART_NAME: RES; CDS_PHYS_PART_NAME: RES_0402-A93549-001,CHIP,0,5%,1/16W,LPDB,GENERIC; WATTAGE: 1/16W; OriginalSymbolOrigin: (-75,25); XY: (4525,3625); VER: 1; PHYS_PAGE: 59; LOCATION: R5914; IP: GENERIC; FP_TECH: LPDB; DRAWING: @RVP1_ADL_SB_ADP_S_DDR5_SODIMM_2DPC_LIB.H55_DG2_2DPC(SCH_1):PAGE59; CDS_LIB: discrete; PCB Footprint: SMR0402IA; ROT: 0; CDS_PART_NAME: RES_0402-A93549-001,CHIP,0,5%,1/16W,LPDB,GENERIC; CDS_LOCATION: R5914; ASI_MODEL: A93549-001
R5915 = RES#1: PART_NUMBER: A93549-001; CHIPS_PART_NAME: RES; CDS_PHYS_PART_NAME: RES_0402-A93549-001,CHIP,0,5%,1/16W,LPDB,GENERIC; WATTAGE: 1/16W; OriginalSymbolOrigin: (-75,25); XY: (4575,4400); VER: 1; PHYS_PAGE: 59; LOCATION: R5915; IP: GENERIC; FP_TECH: LPDB; DRAWING: @RVP1_ADL_SB_ADP_S_DDR5_SODIMM_2DPC_LIB.H55_DG2_2DPC(SCH_1):PAGE59; CDS_LIB: discrete; PCB Footprint: SMR0402IA; ROT: 0; CDS_PART_NAME: RES_0402-A93549-001,CHIP,0,5%,1/16W,LPDB,GENERIC; CDS_LOCATION: R5915; ASI_MODEL: A93549-001
R5916 = RES: CDS_PHYS_PART_NAME: RES_0402-A93549-001,EMPTY,0,5%,1/16W,LPDB,GENERIC; OriginalSymbolOrigin: (-25,75); XY: (2750,4650); VER: 2; PHYS_PAGE: 59; LOCATION: R5916; IP: GENERIC; FP_TECH: LPDB; DRAWING: @RVP1_ADL_SB_ADP_S_DDR5_SODIMM_2DPC_LIB.H55_DG2_2DPC(SCH_1):PAGE59; CDS_LIB: discrete; PCB Footprint: SMR0402IA; ROT: 0; CHIPS_PART_NAME: RES; CDS_PART_NAME: RES_0402-A93549-001,EMPTY,0,5%,1/16W,LPDB,GENERIC; CDS_LOCATION: R5916; ASI_MODEL: A93549-001
R5917 = RES: CDS_PHYS_PART_NAME: RES_0402-A93549-001,EMPTY,0,5%,1/16W,LPDB,GENERIC; OriginalSymbolOrigin: (-25,75); XY: (2775,3875); VER: 2; PHYS_PAGE: 59; LOCATION: R5917; IP: GENERIC; FP_TECH: LPDB; DRAWING: @RVP1_ADL_SB_ADP_S_DDR5_SODIMM_2DPC_LIB.H55_DG2_2DPC(SCH_1):PAGE59; CDS_LIB: discrete; PCB Footprint: SMR0402IA; ROT: 0; CHIPS_PART_NAME: RES; CDS_PART_NAME: RES_0402-A93549-001,EMPTY,0,5%,1/16W,LPDB,GENERIC; CDS_LOCATION: R5917; ASI_MODEL: A93549-001
R5918 = C_RES#1: PART_NUMBER: G22178-002; CHIPS_PART_NAME: C_RES; CDS_PHYS_PART_NAME: C_RES_0603-G22178-002,RES,0,5%,0.1W,TK0,GENERIC; CDS_LMAN_SYM_OUTLINE: -50,50,50,-50; FP_TECH: TK0; IP: GENERIC; ROOM: NONE; OriginalSymbolOrigin: (-75,25); XY: (8125,2750); VER: 1; PHYS_PAGE: 59; LOCATION: R5918; DRAWING: @RVP1_ADL_SB_ADP_S_DDR5_SODIMM_2DPC_LIB.H55_DG2_2DPC(SCH_1):PAGE59; CDS_LIB: c_discrete; MATERIAL: RES; VARIANT: ?; PCB Footprint: CTK0_SM0603_1700X950_MA; ROT: 0; CDS_PART_NAME: C_RES_0603-G22178-002,RES,0,5%,0.1W,TK0,GENERIC; CDS_LOCATION: R5918
R5919 = C_RES#1: PART_NUMBER: G22178-002; CHIPS_PART_NAME: C_RES; CDS_PHYS_PART_NAME: C_RES_0603-G22178-002,RES,0,5%,0.1W,TK0,GENERIC; CDS_LMAN_SYM_OUTLINE: -50,50,50,-50; FP_TECH: TK0; IP: GENERIC; ROOM: NONE; OriginalSymbolOrigin: (-75,25); XY: (8275,3550); VER: 1; PHYS_PAGE: 59; LOCATION: R5919; DRAWING: @RVP1_ADL_SB_ADP_S_DDR5_SODIMM_2DPC_LIB.H55_DG2_2DPC(SCH_1):PAGE59; CDS_LIB: c_discrete; MATERIAL: RES; VARIANT: ?; PCB Footprint: CTK0_SM0603_1700X950_MA; ROT: 0; CDS_PART_NAME: C_RES_0603-G22178-002,RES,0,5%,0.1W,TK0,GENERIC; CDS_LOCATION: R5919
R5920 = C_RES#1: PART_NUMBER: G22178-002; CHIPS_PART_NAME: C_RES; CDS_PHYS_PART_NAME: C_RES_0603-G22178-002,RES,0,5%,0.1W,TK0,GENERIC; CDS_LMAN_SYM_OUTLINE: -50,50,50,-50; FP_TECH: TK0; IP: GENERIC; ROOM: NONE; OriginalSymbolOrigin: (-75,25); XY: (8300,4050); VER: 1; PHYS_PAGE: 59; LOCATION: R5920; DRAWING: @RVP1_ADL_SB_ADP_S_DDR5_SODIMM_2DPC_LIB.H55_DG2_2DPC(SCH_1):PAGE59; CDS_LIB: c_discrete; MATERIAL: RES; VARIANT: ?; PCB Footprint: CTK0_SM0603_1700X950_MA; ROT: 0; CDS_PART_NAME: C_RES_0603-G22178-002,RES,0,5%,0.1W,TK0,GENERIC; CDS_LOCATION: R5920
R5921 = C_RES#1: PART_NUMBER: G22178-002; CHIPS_PART_NAME: C_RES; CDS_PHYS_PART_NAME: C_RES_0603-G22178-002,RES,0,5%,0.1W,TK0,GENERIC; CDS_LMAN_SYM_OUTLINE: -50,50,50,-50; FP_TECH: TK0; IP: GENERIC; ROOM: NONE; OriginalSymbolOrigin: (-75,25); XY: (8300,3850); VER: 1; PHYS_PAGE: 59; LOCATION: R5921; DRAWING: @RVP1_ADL_SB_ADP_S_DDR5_SODIMM_2DPC_LIB.H55_DG2_2DPC(SCH_1):PAGE59; CDS_LIB: c_discrete; MATERIAL: RES; VARIANT: ?; PCB Footprint: CTK0_SM0603_1700X950_MA; ROT: 0; CDS_PART_NAME: C_RES_0603-G22178-002,RES,0,5%,0.1W,TK0,GENERIC; CDS_LOCATION: R5921
R5922 = C_RES#1: PART_NUMBER: G22178-002; CHIPS_PART_NAME: C_RES; CDS_PHYS_PART_NAME: C_RES_0603-G22178-002,EMPTY,0,5%,0.1W,TK0,GENERIC; CDS_LMAN_SYM_OUTLINE: -50,50,50,-50; FP_TECH: TK0; IP: GENERIC; ROOM: NONE; OriginalSymbolOrigin: (-75,25); XY: (7900,3800); VER: 1; PHYS_PAGE: 59; LOCATION: R5922; DRAWING: @RVP1_ADL_SB_ADP_S_DDR5_SODIMM_2DPC_LIB.H55_DG2_2DPC(SCH_1):PAGE59; CDS_LIB: c_discrete; VARIANT: ?; PCB Footprint: CTK0_SM0603_1700X950_MA; ROT: 0; CDS_PART_NAME: C_RES_0603-G22178-002,EMPTY,0,5%,0.1W,TK0,GENERIC; CDS_LOCATION: R5922
R5923 = C_RES#1: PART_NUMBER: G22178-002; CHIPS_PART_NAME: C_RES; CDS_PHYS_PART_NAME: C_RES_0603-G22178-002,RES,0,5%,0.1W,TK0,GENERIC; CDS_LMAN_SYM_OUTLINE: -50,50,50,-50; FP_TECH: TK0; IP: GENERIC; ROOM: NONE; OriginalSymbolOrigin: (-75,25); XY: (7900,3750); VER: 1; PHYS_PAGE: 59; LOCATION: R5923; DRAWING: @RVP1_ADL_SB_ADP_S_DDR5_SODIMM_2DPC_LIB.H55_DG2_2DPC(SCH_1):PAGE59; CDS_LIB: c_discrete; MATERIAL: RES; VARIANT: ?; PCB Footprint: CTK0_SM0603_1700X950_MA; ROT: 0; CDS_PART_NAME: C_RES_0603-G22178-002,RES,0,5%,0.1W,TK0,GENERIC; CDS_LOCATION: R5923
R5924 = RES: CDS_PHYS_PART_NAME: RES_0402-A93549-001,EMPTY,0,5%,1/16W,LPDB,GENERIC; OriginalSymbolOrigin: (-25,75); XY: (2750,3000); VER: 2; PHYS_PAGE: 59; LOCATION: R5924; IP: GENERIC; FP_TECH: LPDB; DRAWING: @RVP1_ADL_SB_ADP_S_DDR5_SODIMM_2DPC_LIB.H55_DG2_2DPC(SCH_1):PAGE59; CDS_LIB: discrete; PCB Footprint: SMR0402IA; ROT: 0; CHIPS_PART_NAME: RES; CDS_PART_NAME: RES_0402-A93549-001,EMPTY,0,5%,1/16W,LPDB,GENERIC; CDS_LOCATION: R5924; ASI_MODEL: A93549-001
R5925 = RES: CDS_PHYS_PART_NAME: RES_0402-A93549-001,EMPTY,0,5%,1/16W,LPDB,GENERIC; OriginalSymbolOrigin: (-25,75); XY: (2775,2225); VER: 2; PHYS_PAGE: 59; LOCATION: R5925; IP: GENERIC; FP_TECH: LPDB; DRAWING: @RVP1_ADL_SB_ADP_S_DDR5_SODIMM_2DPC_LIB.H55_DG2_2DPC(SCH_1):PAGE59; CDS_LIB: discrete; PCB Footprint: SMR0402IA; ROT: 0; CHIPS_PART_NAME: RES; CDS_PART_NAME: RES_0402-A93549-001,EMPTY,0,5%,1/16W,LPDB,GENERIC; CDS_LOCATION: R5925; ASI_MODEL: A93549-001
R5926 = RES#1: PART_NUMBER: A93549-001; CHIPS_PART_NAME: RES; CDS_PHYS_PART_NAME: RES_0402-A93549-001,EMPTY,0,5%,1/16W,LPDB,GENERIC; WATTAGE: 1/16W; OriginalSymbolOrigin: (-75,25); XY: (3325,2475); VER: 1; PHYS_PAGE: 59; LOCATION: R5926; IP: GENERIC; FP_TECH: LPDB; DRAWING: @RVP1_ADL_SB_ADP_S_DDR5_SODIMM_2DPC_LIB.H55_DG2_2DPC(SCH_1):PAGE59; CDS_LIB: discrete; PCB Footprint: SMR0402IA; ROT: 0; CDS_PART_NAME: RES_0402-A93549-001,EMPTY,0,5%,1/16W,LPDB,GENERIC; CDS_LOCATION: R5926; ASI_MODEL: A93549-001
R5927 = RES#1: PART_NUMBER: A93549-001; CHIPS_PART_NAME: RES; CDS_PHYS_PART_NAME: RES_0402-A93549-001,EMPTY,0,5%,1/16W,LPDB,GENERIC; WATTAGE: 1/16W; OriginalSymbolOrigin: (-75,25); XY: (3325,1725); VER: 1; PHYS_PAGE: 59; LOCATION: R5927; IP: GENERIC; FP_TECH: LPDB; DRAWING: @RVP1_ADL_SB_ADP_S_DDR5_SODIMM_2DPC_LIB.H55_DG2_2DPC(SCH_1):PAGE59; CDS_LIB: discrete; PCB Footprint: SMR0402IA; ROT: 0; CDS_PART_NAME: RES_0402-A93549-001,EMPTY,0,5%,1/16W,LPDB,GENERIC; CDS_LOCATION: R5927; ASI_MODEL: A93549-001
R5928 = RES: CDS_PHYS_PART_NAME: RES_0402-A93549-017,CHIP,2.2K,5%,1/16W,LPDB,GENERIC; WATTAGE: 1/16W; OriginalSymbolOrigin: (-25,75); XY: (4275,3025); VER: 2; ROT: 0; PHYS_PAGE: 59; LOCATION: R5928; IP: GENERIC; FP_TECH: LPDB; FIN: PCH; DRAWING: @RVP1_ADL_SB_ADP_S_DDR5_SODIMM_2DPC_LIB.H55_DG2_2DPC(SCH_1):PAGE59; CDS_LIB: discrete; PCB Footprint: SMR0402IA; CHIPS_PART_NAME: RES; CDS_PART_NAME: RES_0402-A93549-017,CHIP,2.2K,5%,1/16W,LPDB,GENERIC; CDS_LOCATION: R5928; ASI_MODEL: A93549-017
R5929 = RES: CDS_PHYS_PART_NAME: RES_0402-A93549-017,CHIP,2.2K,5%,1/16W,LPDB,GENERIC; WATTAGE: 1/16W; OriginalSymbolOrigin: (-25,75); XY: (4275,2225); VER: 2; ROT: 0; PHYS_PAGE: 59; LOCATION: R5929; IP: GENERIC; FP_TECH: LPDB; FIN: PCH; DRAWING: @RVP1_ADL_SB_ADP_S_DDR5_SODIMM_2DPC_LIB.H55_DG2_2DPC(SCH_1):PAGE59; CDS_LIB: discrete; PCB Footprint: SMR0402IA; CHIPS_PART_NAME: RES; CDS_PART_NAME: RES_0402-A93549-017,CHIP,2.2K,5%,1/16W,LPDB,GENERIC; CDS_LOCATION: R5929; ASI_MODEL: A93549-017
R5930 = RES#1: PART_NUMBER: A93549-001; CHIPS_PART_NAME: RES; CDS_PHYS_PART_NAME: RES_0402-A93549-001,EMPTY,0,5%,1/16W,LPDB,GENERIC; WATTAGE: 1/16W; OriginalSymbolOrigin: (-75,25); XY: (4525,1975); VER: 1; PHYS_PAGE: 59; LOCATION: R5930; IP: GENERIC; FP_TECH: LPDB; DRAWING: @RVP1_ADL_SB_ADP_S_DDR5_SODIMM_2DPC_LIB.H55_DG2_2DPC(SCH_1):PAGE59; CDS_LIB: discrete; PCB Footprint: SMR0402IA; ROT: 0; CDS_PART_NAME: RES_0402-A93549-001,EMPTY,0,5%,1/16W,LPDB,GENERIC; CDS_LOCATION: R5930; ASI_MODEL: A93549-001
R5931 = RES#1: PART_NUMBER: A93549-001; CHIPS_PART_NAME: RES; CDS_PHYS_PART_NAME: RES_0402-A93549-001,CHIP,0,5%,1/16W,LPDB,GENERIC; WATTAGE: 1/16W; OriginalSymbolOrigin: (-75,25); XY: (4575,2750); VER: 1; PHYS_PAGE: 59; LOCATION: R5931; IP: GENERIC; FP_TECH: LPDB; DRAWING: @RVP1_ADL_SB_ADP_S_DDR5_SODIMM_2DPC_LIB.H55_DG2_2DPC(SCH_1):PAGE59; CDS_LIB: discrete; PCB Footprint: SMR0402IA; ROT: 0; CDS_PART_NAME: RES_0402-A93549-001,CHIP,0,5%,1/16W,LPDB,GENERIC; CDS_LOCATION: R5931; ASI_MODEL: A93549-001
R5932 = C_RES#1: PART_NUMBER: G22178-002; CHIPS_PART_NAME: C_RES; CDS_PHYS_PART_NAME: C_RES_0603-G22178-002,EMPTY,0,5%,0.1W,TK2,GENERIC; CDS_LMAN_SYM_OUTLINE: -50,50,50,-50; FP_TECH: TK2; IP: GENERIC; ROOM: NONE; TOLERANCE: 5%; WATTAGE: 0.1W; OriginalSymbolOrigin: (-75,25); XY: (8825,2050); VER: 1; PHYS_PAGE: 59; DRAWING: @RVP1_ADL_SB_ADP_S_DDR5_SODIMM_2DPC_LIB.H55_DG2_2DPC(SCH_1):PAGE59; CDS_LOCATION: R5932; CDS_LIB: c_discrete; VARIANT: ?; PCB Footprint: CTK2_SM0603_1700X950_MA; ROT: 0; LOCATION: ?; CDS_PART_NAME: C_RES_0603-G22178-002,EMPTY,0,5%,0.1W,TK2,GENERIC
R21052 = C_RES#1: PART_NUMBER: G22178-002; CHIPS_PART_NAME: C_RES; CDS_PHYS_PART_NAME: C_RES_0603-G22178-002,RES,0,5%,0.1W,TK0,GENERIC; CDS_LMAN_SYM_OUTLINE: -50,50,50,-50; FP_TECH: TK0; IP: GENERIC; ROOM: NONE; OriginalSymbolOrigin: (-75,25); XY: (8625,1850); VER: 1; PHYS_PAGE: 59; LOCATION: R21052; DRAWING: @RVP1_ADL_SB_ADP_S_DDR5_SODIMM_2DPC_LIB.H55_DG2_2DPC(SCH_1):PAGE59; CDS_LIB: c_discrete; MATERIAL: RES; VARIANT: ?; PCB Footprint: CTK0_SM0603_1700X950_MA; ROT: 0; CDS_PART_NAME: C_RES_0603-G22178-002,RES,0,5%,0.1W,TK0,GENERIC; CDS_LOCATION: R21052
R26089 = C_RES#1: PART_NUMBER: G22178-002; CHIPS_PART_NAME: C_RES; CDS_PHYS_PART_NAME: C_RES_0603-G22178-002,RES,0,5%,0.1W,TK0,GENERIC; CDS_LMAN_SYM_OUTLINE: -50,50,50,-50; FP_TECH: TK0; IP: GENERIC; ROOM: NONE; OriginalSymbolOrigin: (-75,25); XY: (7150,1000); VER: 1; PHYS_PAGE: 59; LOCATION: R26089; DRAWING: @RVP1_ADL_SB_ADP_S_DDR5_SODIMM_2DPC_LIB.H55_DG2_2DPC(SCH_1):PAGE59; CDS_LIB: c_discrete; MATERIAL: RES; VARIANT: ?; PCB Footprint: CTK0_SM0603_1700X950_MA; ROT: 0; CDS_PART_NAME: C_RES_0603-G22178-002,RES,0,5%,0.1W,TK0,GENERIC; CDS_LOCATION: R26089
R26189 = C_RES#1: PART_NUMBER: G22178-002; CHIPS_PART_NAME: C_RES; CDS_PHYS_PART_NAME: C_RES_0603-G22178-002,RES,0,5%,0.1W,TK0,GENERIC; CDS_LMAN_SYM_OUTLINE: -50,50,50,-50; FP_TECH: TK0; IP: GENERIC; ROOM: NONE; OriginalSymbolOrigin: (-75,25); XY: (8650,975); VER: 1; PHYS_PAGE: 59; LOCATION: R26189; DRAWING: @RVP1_ADL_SB_ADP_S_DDR5_SODIMM_2DPC_LIB.H55_DG2_2DPC(SCH_1):PAGE59; CDS_LIB: c_discrete; MATERIAL: RES; VARIANT: ?; PCB Footprint: CTK0_SM0603_1700X950_MA; ROT: 0; CDS_PART_NAME: C_RES_0603-G22178-002,RES,0,5%,0.1W,TK0,GENERIC; CDS_LOCATION: R26189